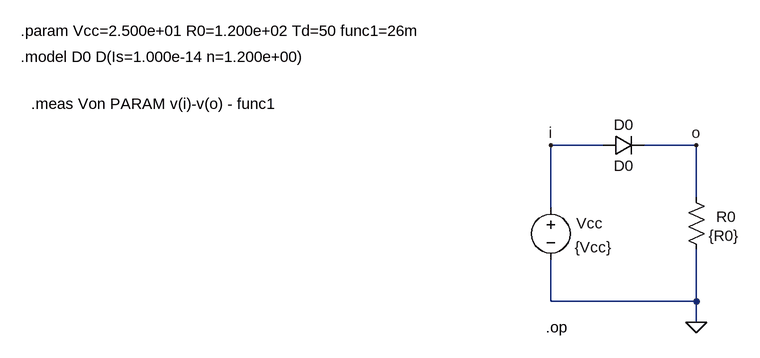
[diagram p0: schematic DIODEMODEL02op.asc]
DIODEMODEL02op.asc, the LTspice schematic file:
Version 4
SHEET 1 1608 1076
WIRE 944 -176 864 -176
WIRE 1088 -176 1008 -176
WIRE 1088 -96 1088 -176
WIRE 864 -80 864 -176
WIRE 864 64 864 0
WIRE 1088 64 1088 -16
WIRE 1088 64 864 64
WIRE 1088 96 1088 64
FLAG 1088 96 0
FLAG 864 -176 i
FLAG 1088 -176 o
SYMBOL voltage 864 -96 R0
WINDOW 123 0 0 Left 0
WINDOW 39 0 0 Left 0
WINDOW 0 39 40 Left 2
WINDOW 3 37 77 Left 2
SYMATTR InstName Vcc
SYMATTR Value {Vcc}
SYMBOL res 1072 -112 R0
WINDOW 0 47 46 Left 2
WINDOW 3 35 75 Left 2
SYMATTR InstName R0
SYMATTR Value {R0}
SYMBOL diode 944 -160 R270
WINDOW 0 32 32 VTop 2
WINDOW 3 0 32 VBottom 2
SYMATTR InstName D0
SYMATTR Value D0
TEXT 856 104 Left 2 !.op
TEXT 48 -352 Left 2 !.param Vcc=2.500e+01 R0=1.200e+02 Td=50 func1=26m
TEXT 48 -312 Left 2 !.model D0 D(Is=1.000e-14 n=1.200e+00)
TEXT 64 -240 Left 2 !.meas Von PARAM v(i)-v(o) - func1

The netlist it stands for:
* DIODEMODEL02op.asc
Vcc i 0 {Vcc}
R0 o 0 {R0}
D0 i o D0
.model D D
.lib standard.dio
.op
.param Vcc=2.500e+01 R0=1.200e+02 Td=50 func1=26m
.model D0 D(Is=1.000e-14 n=1.200e+00)
.meas Von PARAM v(i)-v(o) - func1
.backanno
.end